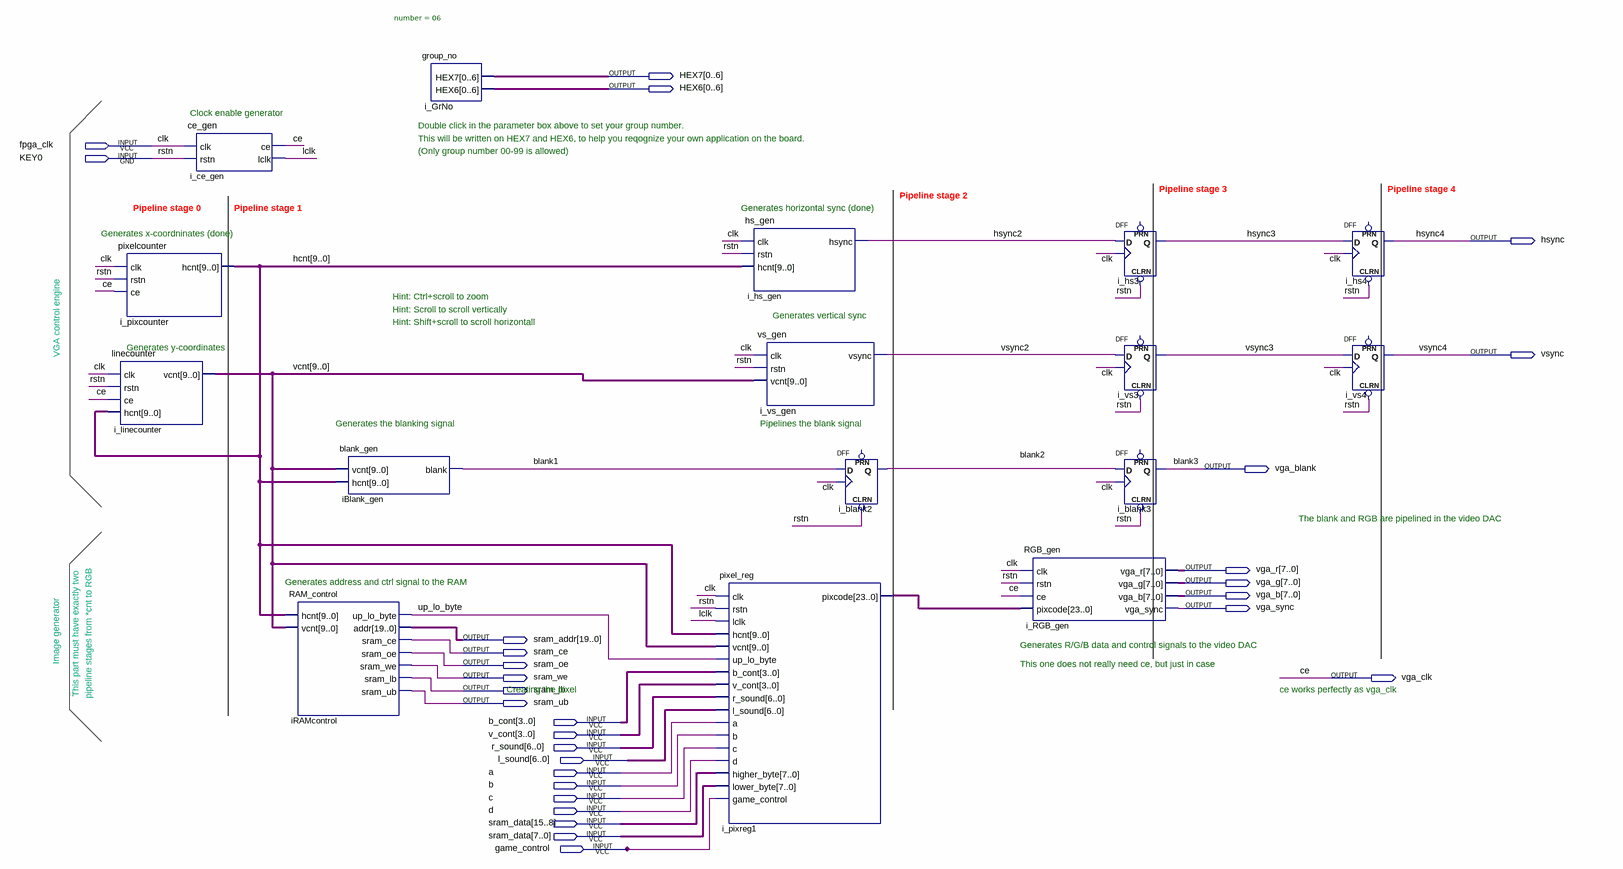
[diagram p0: schematic sheet]
// Quartus schematic VGA_prjt.bdf as structural Verilog: 16 symbols, 29 pins
module VGA_prjt (
  input  fpga_clk,
  input  KEY0,
  input  [3:0] b_cont,
  input  [3:0] v_cont,
  input  [6:0] r_sound,
  input  [6:0] l_sound,
  input  a,
  input  b,
  input  c,
  input  d,
  input  [15:0] sram_data,
  input  game_control,
  output [0:6] HEX7,
  output [0:6] HEX6,
  output hsync,
  output vsync,
  output vga_blank,
  output [7:0] vga_r,
  output [7:0] vga_g,
  output [7:0] vga_b,
  output vga_sync,
  output [19:0] sram_addr,
  output sram_ce,
  output sram_oe,
  output sram_we,
  output vga_clk,
  output sram_lb,
  output sram_ub
);

  wire blank1, blank2, hsync2, hsync3, lclk, up_lo_byte, vsync2, vsync3;
  wire [9:0] hcnt, vcnt;
  wire [23:0] i_pixreg1_pixcode;

  linecounter i_linecounter (.clk(fpga_clk), .rstn(KEY0), .ce(vga_clk), .hcnt(hcnt), .vcnt(vcnt));
  pixelcounter i_pixcounter (.clk(fpga_clk), .rstn(KEY0), .ce(vga_clk), .hcnt(hcnt));
  ce_gen i_ce_gen (.clk(fpga_clk), .rstn(KEY0), .ce(vga_clk), .lclk(lclk));
  RAM_control iRAMcontrol (
    .hcnt(hcnt), .vcnt(vcnt), .addr(sram_addr), .sram_ce(sram_ce), .sram_oe(sram_oe), .sram_we(sram_we),
    .sram_lb(sram_lb), .sram_ub(sram_ub), .up_lo_byte(up_lo_byte));
  blank_gen iBlank_gen (.vcnt(vcnt), .hcnt(hcnt), .blank(blank1));
  group_no #(.number(06)) i_GrNo (.HEX7(HEX7), .HEX6(HEX6));
  pixel_reg i_pixreg1 (
    .clk(fpga_clk), .rstn(KEY0), .lclk(lclk), .hcnt(hcnt), .vcnt(vcnt), .up_lo_byte(up_lo_byte),
    .b_cont(b_cont), .v_cont(v_cont), .r_sound(r_sound), .l_sound(l_sound), .a(a), .b(b), .c(c), .d(d),
    .higher_byte(sram_data[15:8]), .lower_byte(sram_data[7:0]), .game_control(game_control),
    .pixcode(i_pixreg1_pixcode));
  hs_gen i_hs_gen (.clk(fpga_clk), .rstn(KEY0), .hcnt(hcnt), .hsync(hsync2));
  vs_gen i_vs_gen (.clk(fpga_clk), .rstn(KEY0), .vcnt(vcnt), .vsync(vsync2));
  DFF i_blank2 (.CLRN(KEY0), .CLK(fpga_clk), .D(blank1), .Q(blank2));  // open: PRN
  RGB_gen i_RGB_gen (
    .clk(fpga_clk), .rstn(KEY0), .ce(vga_clk), .pixcode(i_pixreg1_pixcode), .vga_r(vga_r), .vga_g(vga_g),
    .vga_b(vga_b), .vga_sync(vga_sync));
  DFF i_hs3 (.CLRN(KEY0), .CLK(fpga_clk), .D(hsync2), .Q(hsync3));  // open: PRN
  DFF i_vs3 (.CLRN(KEY0), .CLK(fpga_clk), .D(vsync2), .Q(vsync3));  // open: PRN
  DFF i_blank3 (.CLRN(KEY0), .CLK(fpga_clk), .D(blank2), .Q(vga_blank));  // open: PRN
  DFF i_hs4 (.CLRN(KEY0), .CLK(fpga_clk), .D(hsync3), .Q(hsync));  // open: PRN
  DFF i_vs4 (.CLRN(KEY0), .CLK(fpga_clk), .D(vsync3), .Q(vsync));  // open: PRN

  // Other names for the same wires on the sheet: blank3 = vga_blank; ce = vga_clk; clk = fpga_clk; hsync4 = hsync;
  //   rstn = KEY0; vsync4 = vsync

  // Notes on the sheet:
  //   Clock enable generator
  //   Double click in the parameter box above to set your group number.
  //   This will be written on HEX7 and HEX6, to help you reqognize your own application on the board.
  //   (Only group number 00-99 is allowed)
  //   Pipeline stage 3
  //   Pipeline stage 4
  //   Pipeline stage 2
  //   Pipeline stage 0
  //   Pipeline stage 1
  //   Generates horizontal sync (done)
  //   Generates x-coordninates (done)
  //   VGA control engine
  //   Hint: Ctrl+scroll to zoom
  //   Hint: Scroll to scroll vertically
  //   Generates vertical sync
  //   Hint: Shift+scroll to scroll horizontall
  //   Generates y-coordinates
  //   Generates the blanking signal
  //   Pipelines the blank signal
  //   The blank and RGB are pipelined in the video DAC
  //   This part must have exactly two
  //   pipeline stages from *cnt to RGB
  //   Generates address and ctrl signal to the RAM
  //   Image generator
  //   Generates R/G/B data and control signals to the video DAC
  //   This one does not really need ce, but just in case
  //   Creating the pixel
  //   ce works perfectly as vga_clk
endmodule
